# EAGLE schematic Boost (EAGLE 7.1.0)
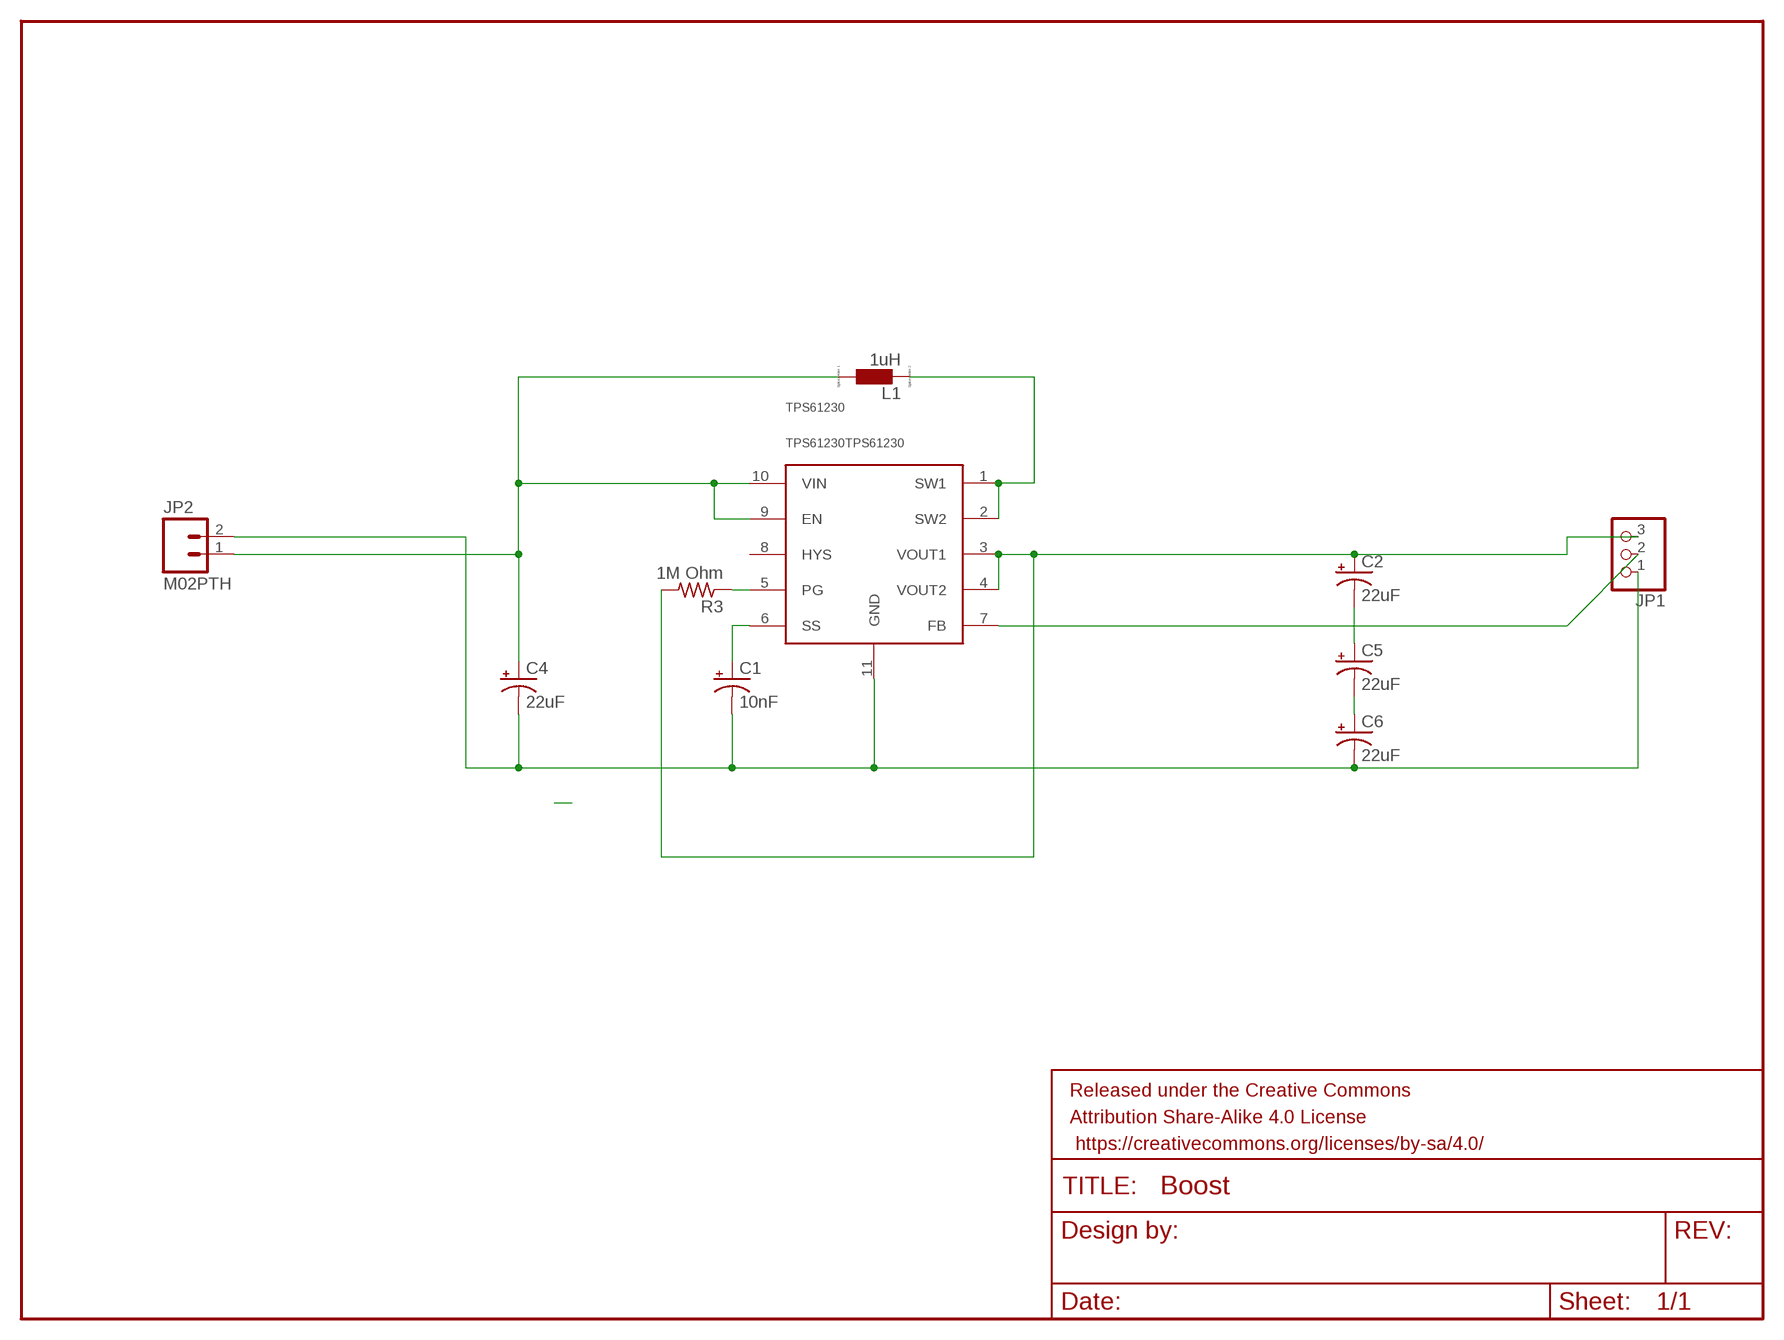
[diagram p0: schematic, sheet 1]

## Parts
C1  10nF  CPOL-USE2.5-5  [E2,5-5]
C2  22uF  CPOL-USE2.5-5  [E2,5-5]
C4  22uF  CPOL-USE2.5-5  [E2,5-5]
C5  22uF  CPOL-USE2.5-5  [E2,5-5]
C6  22uF  CPOL-USE2.5-5  [E2,5-5]
FRAME1  FRAME-LETTER  [CREATIVE_COMMONS]
JP1  PINHD-1X3  [1X03]
JP2  M02PTH  [1X02]
L1  1uH  L0207/10  [0207/10]
R3  1M Ohm  R-US_0207/10  [0207/10]
TPS61230  TPS61230TPS61230  [SON50P300X300X100-11N]

## Nets
N$1: C1.- C4.- C6.- JP1.1 JP2.2 TPS61230.11(GND)
N$2: R3.1 TPS61230.5(PG)
N$3: L1.2 TPS61230.1(SW1) TPS61230.2(SW2)
N$4: C2.+ JP1.3 R3.2 TPS61230.3(VOUT1) TPS61230.4(VOUT2)
N$5: JP1.2 TPS61230.7(FB)
N$7: C1.+ TPS61230.6(SS)
N$8: C4.+ JP2.1 L1.1 TPS61230.9(EN) TPS61230.10(VIN)
N$9: C5.- C6.+
N$10: C2.- C5.+
Unconnected: TPS61230.8(HYS)

## Library data of the parts
C1 C2 C4-C6 = adafruit:CPOL-US: POLARIZED CAPACITOR, American symbol
FRAME1 = SparkFun-Aesthetics:FRAME-LETTER: Schematic Frame Standard 8.5x11 US Letter frame
JP1 = adafruit:PINHD-1X3: PIN HEADER
JP2 = SparkFun-Connectors:M02: Standard 2-pin 0.1" header. Use with - straight break away headers ( PRT-00116) - right angle break away headers (PRT-00553) - swiss pins (PRT-00743) - machine pins (PRT-00117) - female headers (PRT-00115) Molex polarized connector foot print use with: PRT-08233 with associated crimp pins and housings. 2.54_SCREWTERM for use with PRT-10571. 3.5mm Screw Terminal footprints for PRT-08084 5mm Screw Terminal footprints for use with PRT-08432
L1 = eagle-ltspice:L: INDUCTOR, European symbol; SPICEMODEL: NONE; SPICEPREFIX: L
R3 = adafruit:R-US_: RESISTOR, American symbol
TPS61230 = TPS61230:TPS61230